# EAGLE design x_carriage (EAGLE 7.1.0)
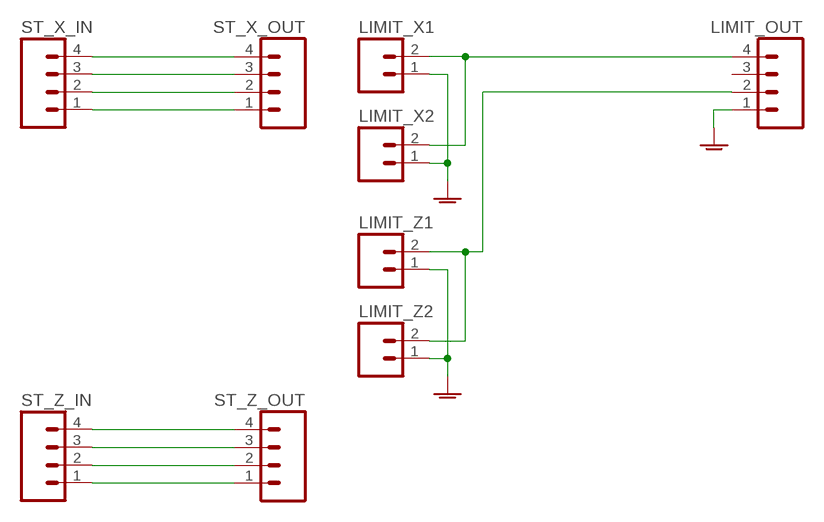
[diagram p0: schematic, sheet 1]

## Parts
LIMIT_OUT  M04PTH  [1X04]
LIMIT_X1  M02POLAR  [MOLEX-1X2]
LIMIT_X2  M02POLAR  [MOLEX-1X2]
LIMIT_Z1  M02POLAR  [MOLEX-1X2]
LIMIT_Z2  M02POLAR  [MOLEX-1X2]
ST_X_IN  M04POLAR  [MOLEX-1X4]
ST_X_OUT  M04PTH  [1X04]
ST_Z_IN  M04POLAR  [MOLEX-1X4]
ST_Z_OUT  M04PTH  [1X04]

## Nets
GNDA: LIMIT_OUT.1 LIMIT_X1.1 LIMIT_X2.1 LIMIT_Z1.1 LIMIT_Z2.1
N$1: ST_X_IN.4 ST_X_OUT.4
N$2: ST_X_IN.3 ST_X_OUT.3
N$3: ST_X_IN.2 ST_X_OUT.2
N$4: ST_X_IN.1 ST_X_OUT.1
N$7: LIMIT_OUT.4 LIMIT_X1.2 LIMIT_X2.2
N$11: LIMIT_OUT.2 LIMIT_Z1.2 LIMIT_Z2.2
N$13: ST_Z_IN.4 ST_Z_OUT.4
N$14: ST_Z_IN.3 ST_Z_OUT.3
N$15: ST_Z_IN.2 ST_Z_OUT.2
N$16: ST_Z_IN.1 ST_Z_OUT.1
Unconnected: LIMIT_OUT.3

## Library data of the parts
LIMIT_OUT ST_X_IN ST_X_OUT ST_Z_IN ST_Z_OUT = SparkFun-Connectors:M04: Header 4 Standard 4-pin 0.1" header. Use with straight break away headers (SKU : PRT-00116), right angle break away headers (PRT-00553), swiss pins (PRT-00743), machine pins (PRT-00117), and female headers (PRT-00115). Molex polarized connector foot print use with SKU : PRT-08231 with associated crimp pins and housings. 1MM SMD Version SKU: PRT-10208
LIMIT_X1 LIMIT_X2 LIMIT_Z1 LIMIT_Z2 = SparkFun-Connectors:M02: Standard 2-pin 0.1" header. Use with - straight break away headers ( PRT-00116) - right angle break away headers (PRT-00553) - swiss pins (PRT-00743) - machine pins (PRT-00117) - female headers (PRT-00115) Molex polarized connector foot print use with: PRT-08233 with associated crimp pins and housings. 2.54_SCREWTERM for use with PRT-10571. 3.5mm Screw Terminal footprints for PRT-08084 5mm Screw Terminal footprints for use with PRT-08433

## Board
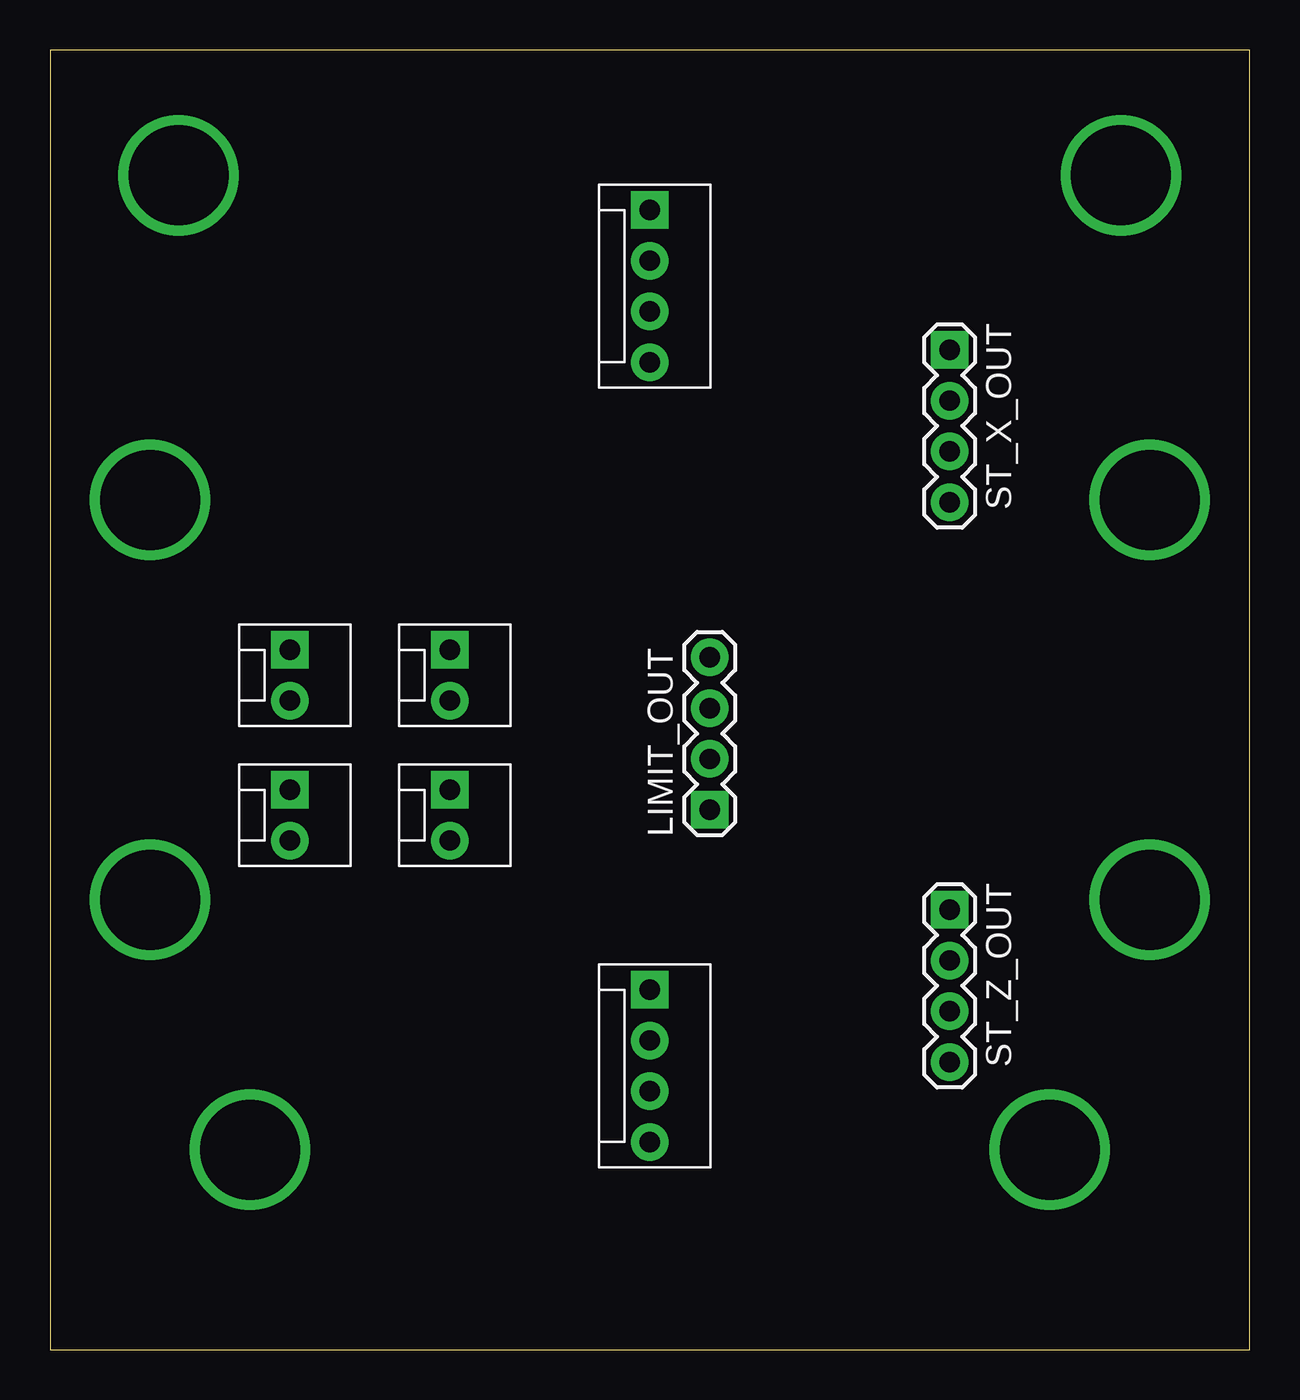
[diagram p1: board, top side]
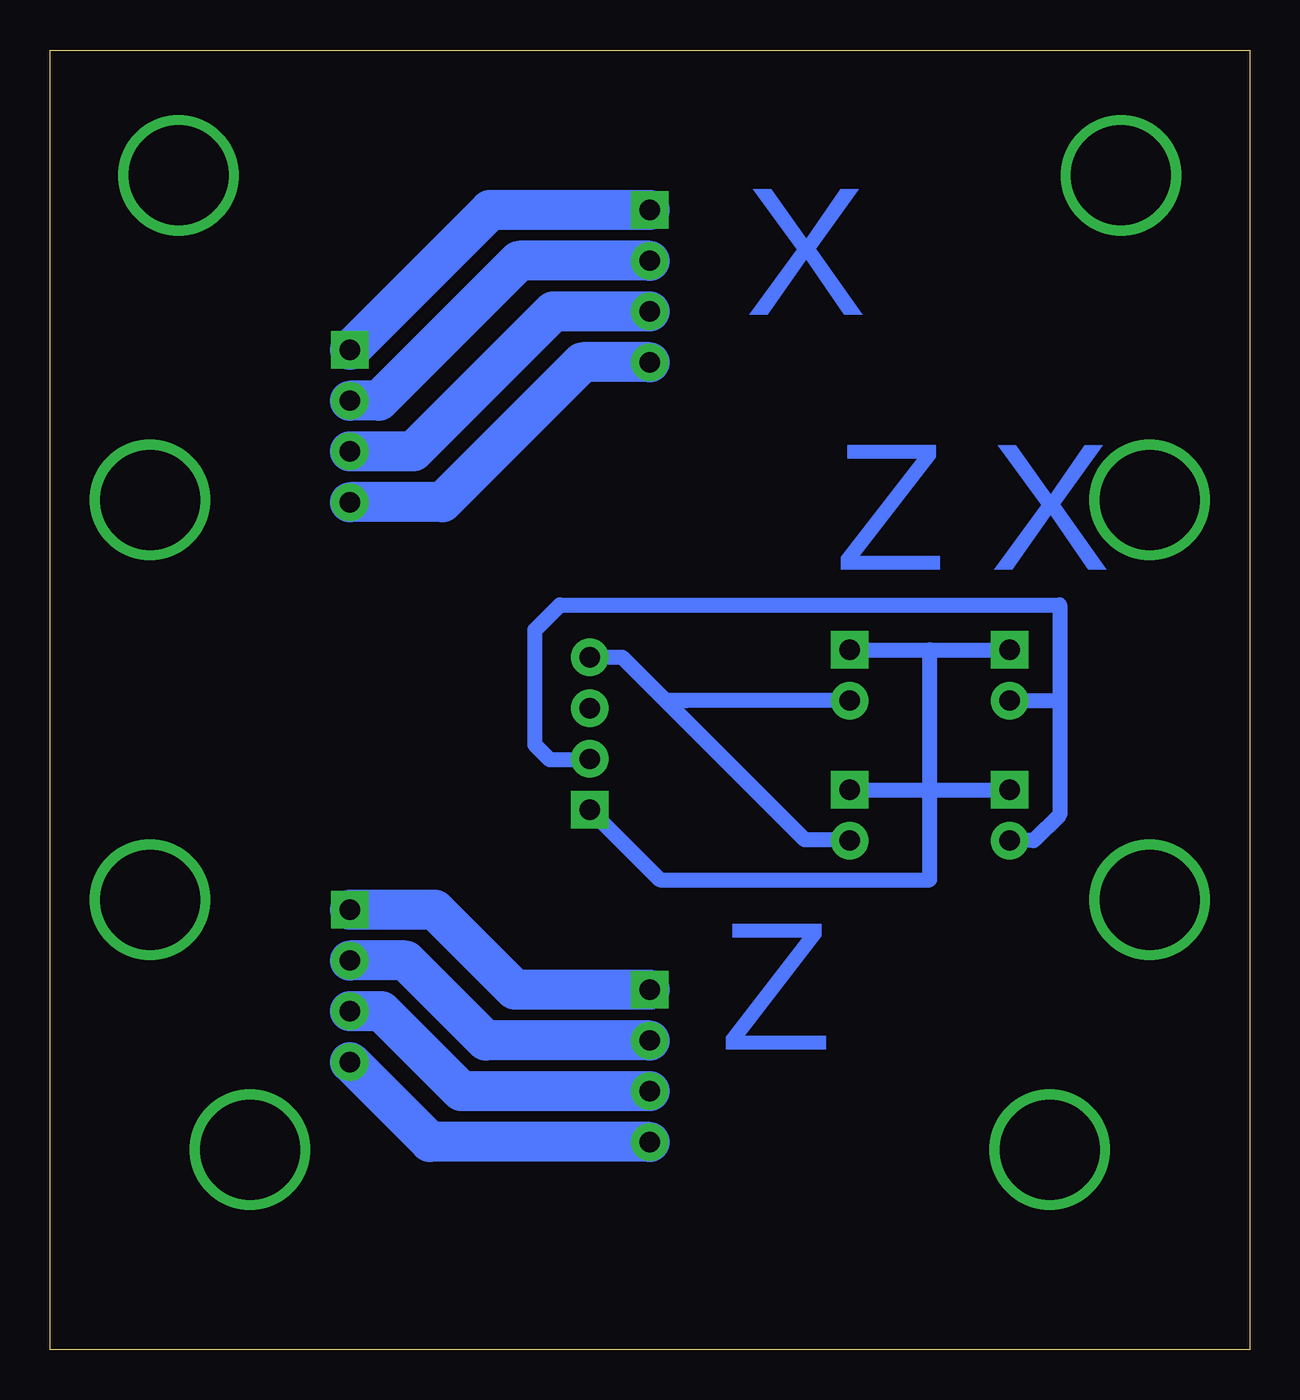
[diagram p2: board, bottom side, seen from below]

Size 60 x 65 mm. Coordinates in mm from the lower left corner, seen from the top.
Outline: 0,0 60,0 60,65 0,65 0,0
Copper layers (1*16): Top 0.035mm / dielectric 1.5mm / Bottom 0.035mm
Design rules "default *": minimum track width 10mil, minimum drill 24mil, track to track 10mil, track to pad 10mil, pad to pad 10mil, via to via 10mil, smd to smd 10mil, copper to edge 20mil, drill to drill 8mil, minimum pad ring 10mil, minimum via ring 8mil, stop-mask expansion 4mil, vias tented up to drill 0mil, thermal gap 10mil

### Footprints (pad centres in the part's own frame; a part is rotated, then mirrored left to right if it is on the bottom)
1X04 = drill 1.016 pad 1.88 square: 1 0,0 | drill 1.016 pad 1.88: 2 2.54,0; 3 5.08,0; 4 7.62,0
MOLEX-1X2 = drill 1.016 pad 1.88 square: 1 0,0 | drill 1.016 pad 1.88: 2 2.54,0
MOLEX-1X4 = drill 1.016 pad 1.88 square: 1 0,0 | drill 1.016 pad 1.88: 2 2.54,0; 3 5.08,0; 4 7.62,0

### Placement (x,y rotation side)
LIMIT_OUT  33,27 90 top
LIMIT_X1  20,35 270 top
LIMIT_X2  20,28 270 top
LIMIT_Z1  12,28 270 top
LIMIT_Z2  12,35 270 top
ST_X_IN  30,57 270 top
ST_X_OUT  45,50 270 top
ST_Z_IN  30,18 270 top
ST_Z_OUT  45,22 270 top

### Tracks (layer width: path | path; a pad name or v marks a point on that pad's centre or on a via)
GNDA
  Bottom 0.75: 16,28 16,35 | LIMIT_X1.1 16,35 | 16,35 LIMIT_Z2.1 | LIMIT_X2.1 16,28 | 16,28 LIMIT_Z1.1 | LIMIT_OUT.1 29.5,23.5 16,23.5 16,28
N$1
  Bottom 2: ST_X_IN.4 33.37,49.38 40.37,42.38 ST_X_OUT.4
N$2
  Bottom 2: ST_X_IN.3 34.83,51.92 41.83,44.92 ST_X_OUT.3
N$3
  Bottom 2: ST_X_IN.2 36.54,54.46 43.54,47.46 ST_X_OUT.2
N$4
  Bottom 2: ST_X_IN.1 38,57 ST_X_OUT.1
N$5  (via drill 5 pad 0.5)
  other vias: 10,10
N$6  (via drill 5 pad 0.5)
  other vias: 50,10
N$7
  Bottom 0.75: LIMIT_X1.2 28.21,32.46 29.25,32.5 | 29.25,32.5 31.37,34.62 LIMIT_OUT.4 | LIMIT_X2.2 20.04,25.5 22.25,25.5 29.25,32.5
N$9  (via drill 5 pad 0.5)
  other vias: 53.57,58.73
N$11
  Bottom 0.75: LIMIT_Z2.2 9.5,32.46 | 9.5,32.46 9.5,26.75 10.79,25.46 LIMIT_Z1.2 | LIMIT_OUT.2 33.04,29.5 35,29.5 35.75,30.25 35.75,36 34.5,37.25 9.5,37.25 9.5,32.46
N$12  (via drill 5 pad 0.5)
  other vias: 6.43,58.73
N$13
  Bottom 2: ST_Z_IN.4 41,10.38 ST_Z_OUT.4
N$14
  Bottom 2: ST_Z_IN.3 39.42,12.92 43.42,16.92 ST_Z_OUT.3
N$15
  Bottom 2: ST_Z_IN.2 38.21,15.46 42.21,19.46 ST_Z_OUT.2
N$16
  Bottom 2: ST_Z_IN.1 36.75,18 40.75,22 ST_Z_OUT.1
N$18  (via drill 5 pad 0.5)
  other vias: 55,42.5
N$19  (via drill 5 pad 0.5)
  other vias: 55,22.5
N$20  (via drill 5 pad 0.5)
  other vias: 5,22.5
N$21  (via drill 5 pad 0.5)
  other vias: 5,42.5

### Text on the board
Bottom: X | X | Z | Z